# Altium schematic sheet Power_Supply iso backup.SchDoc: Power Supply
size A3; Author: M.Beldyga; CompanyName: WUT ISE; DrawnBy: M.Beldyga; Organization: WUT ISE; Address1: PW ISE; Address2: Nowowiejska 15/19 00-665 Warsaw; Address3: micbeldyga@gmail.com; SheetNumber: 1; SheetTotal: 1; ModifiedBy: -; CheckedDate: -; Title2: +/- 2kV, +/- 15V, 5V; DivGrp: WUT ISE; Designer: M.Beldyga; ModifiedDate: -; ProjectName: Sensor Box
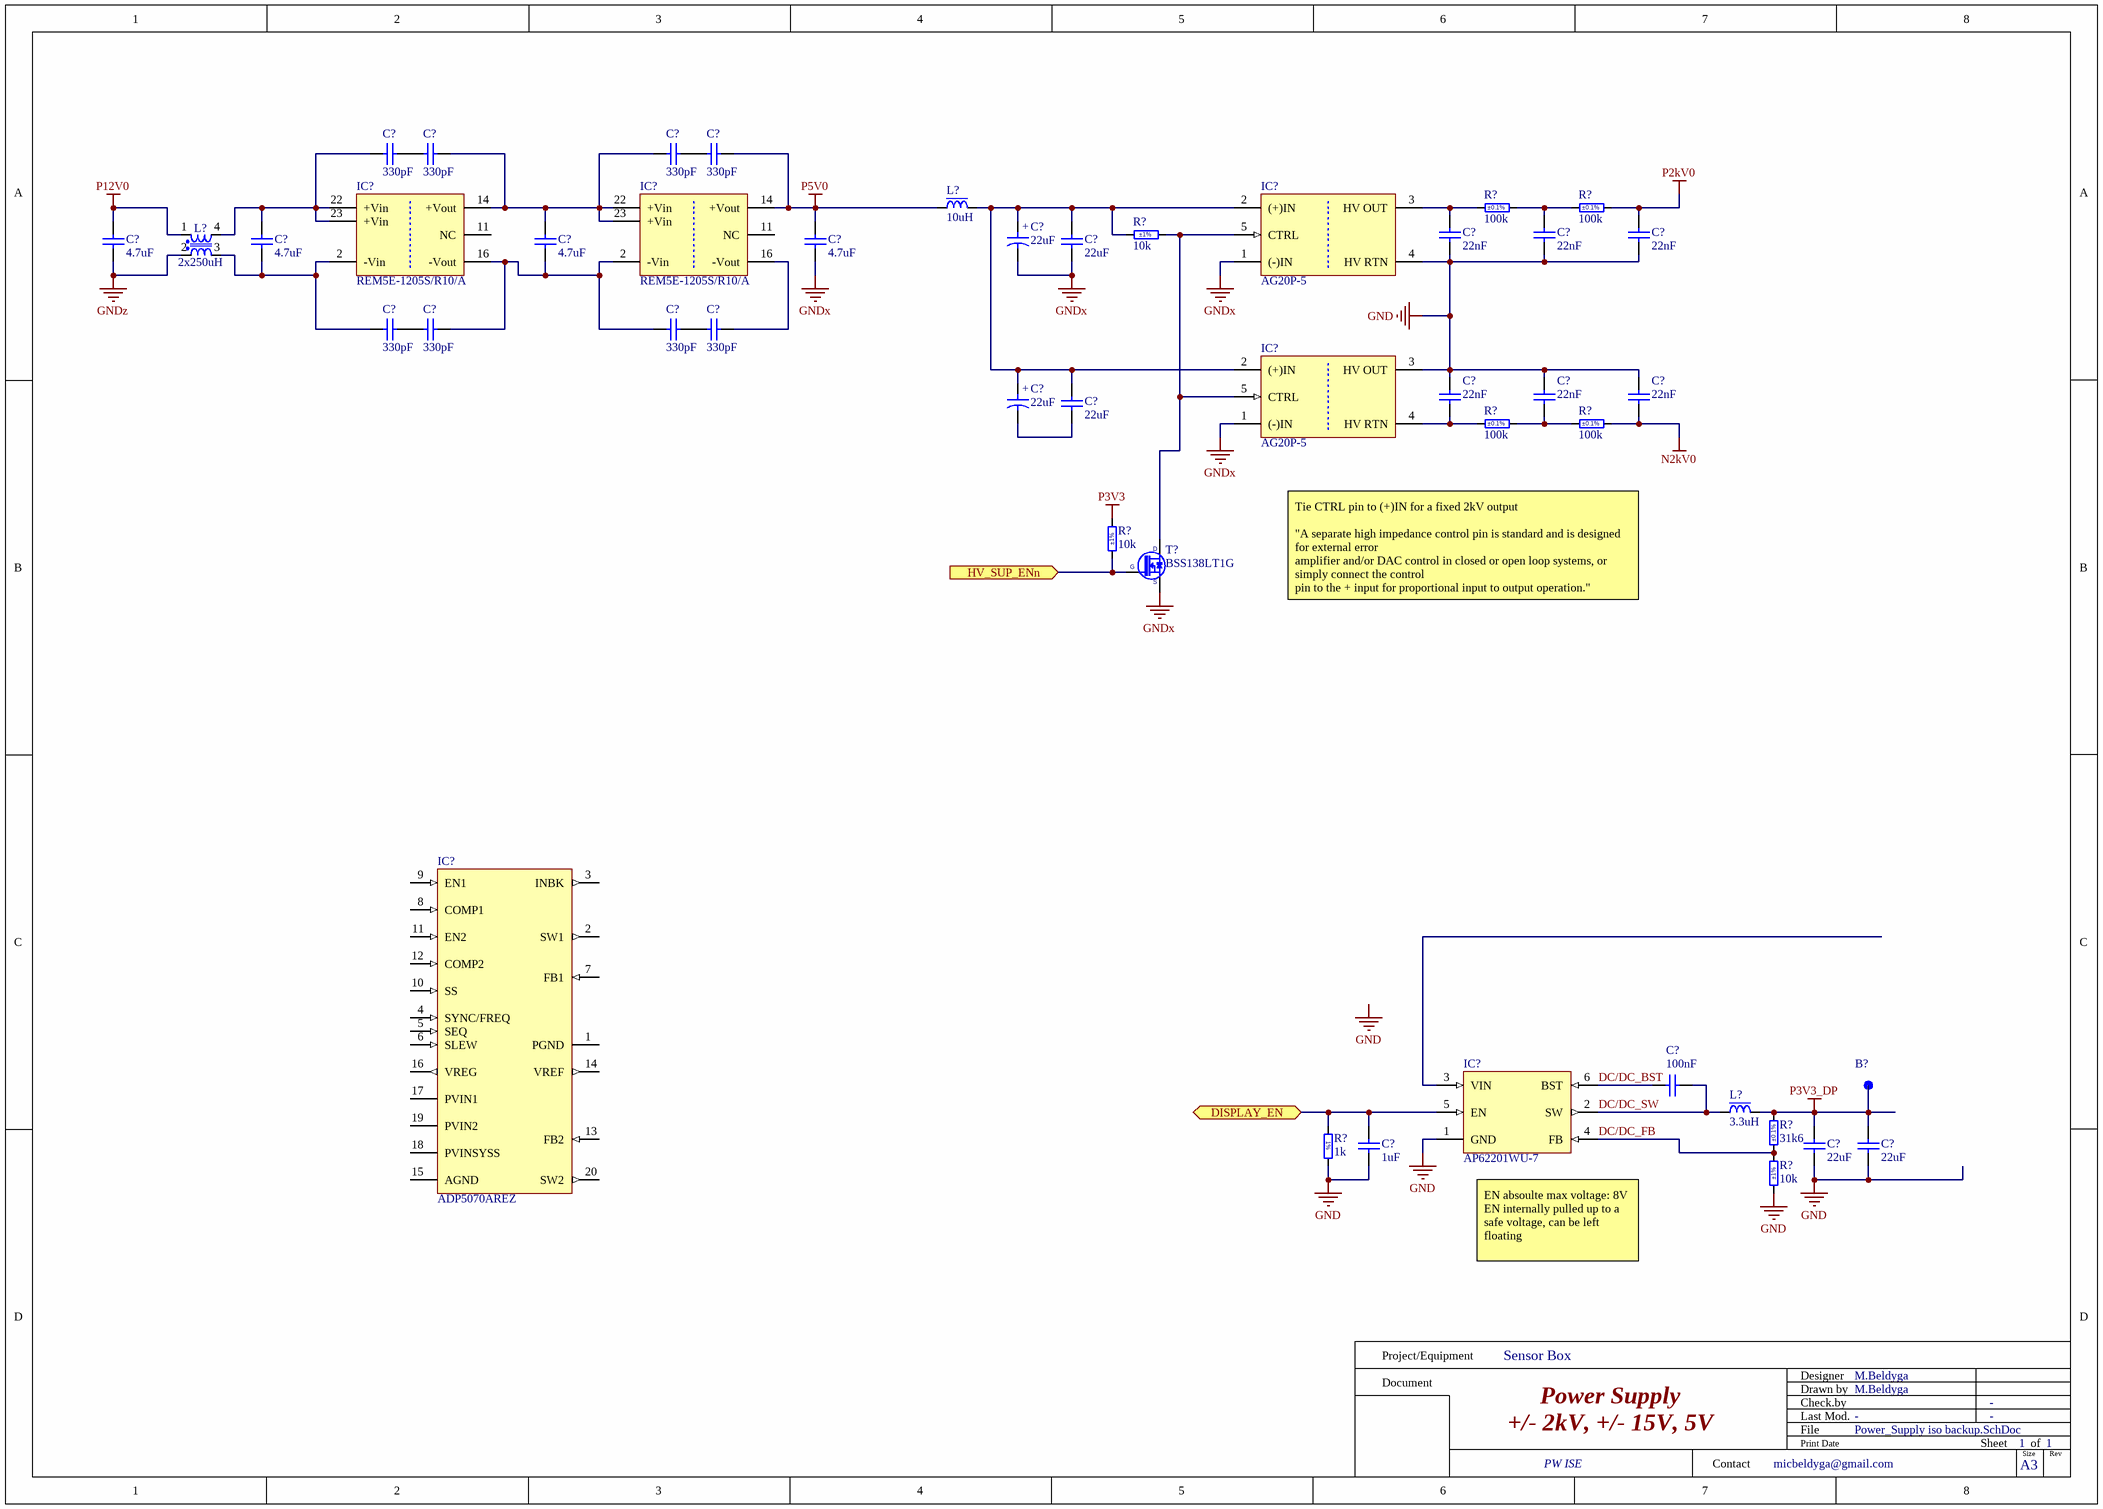
[diagram p0: Power_Supply iso backup.SchDoc]

## Parts
(Parts that share a designator on the sheet are numbered #1, #2 ... from top to bottom, then left to right.)
B?  SMD Pad  [C100]  (value not drawn)  (no BOM)
C?#1  330pF  [CAPC4620X220N]
C?#2  330pF  [CAPC4620X220N]
C?#3  330pF  [CAPC4620X220N]
C?#4  330pF  [CAPC4620X220N]
C?#5  22uF  [CAPMP3528X210N]
C?#6  22nF  [CAPC5764X279N]
C?#7  22nF  [CAPC5764X279N]
C?#8  22nF  [CAPC5764X279N]
C?#9  4.7uF  [CAPC2012X145N]
C?#10  4.7uF  [CAPC2012X145N]
C?#11  4.7uF  [CAPC2012X145N]
C?#12  4.7uF  [CAPC2012X145N]
C?#13  22uF  [CAPC3216X180N]
C?#14  330pF  [CAPC4620X220N]
C?#15  330pF  [CAPC4620X220N]
C?#16  330pF  [CAPC4620X220N]
C?#17  330pF  [CAPC4620X220N]
C?#18  22uF  [CAPMP3528X210N]
C?#19  22nF  [CAPC5764X279N]
C?#20  22nF  [CAPC5764X279N]
C?#21  22nF  [CAPC5764X279N]
C?#22  22uF  [CAPC3216X180N]
C?#23  100nF  [CAPC1005X55N]
C?#24  1uF  [CAPC1005X55N]
C?#25  22uF  [CAPC2012X135N]
C?#26  22uF  [CAPC2012X135N]
IC?#1  REM5E-1205S/R10/A  [DCDC_RECOM_REM5E-XXXXS]
IC?#2  REM5E-1205S/R10/A  [DCDC_RECOM_REM5E-XXXXS]
IC?#3  AG20P-5  [DCDC_XPPOWER_AG0-2KV]
IC?#4  AG20P-5  [DCDC_XPPOWER_AG0-2KV]
IC?#5  ADP5070AREZ  [SOP65P640X120-21N-R305X425]
IC?#6  AP62201WU-7  [SOT95P280X100-6N]
L?#1  10uH  [IND_BOURNS_PM43]
L?#2  2x250uH  [IND_WURTH_WE-SL2]
L?#3  3.3uH  [IND_WURTH_WE-TPC_4828]
R?#1  100k  Tolerance: ±0.1%  [RESC3216X50N]
R?#2  100k  Tolerance: ±0.1%  [RESC3216X50N]
R?#3  10k  Tolerance: ±1%  [RESC1005X40N]
R?#4  100k  Tolerance: ±0.1%  [RESC3216X50N]
R?#5  100k  Tolerance: ±0.1%  [RESC3216X50N]
R?#6  10k  Tolerance: ±1%  [RESC1005X40N]
R?#7  1k  [RESC1005X40N]
R?#8  31k6  Tolerance: ±0.1%  [RESC1005X35N]
R?#9  10k  Tolerance: ±1%  [RESC1005X40N]
T?  BSS138LT1G  [SOT95P240X110-3N]

## Ports
DISPLAY_EN (bidir), HV_SUP_ENn (in)

## Nets
GND: C?#6.1 C?#7.1 C?#8.1 C?#19.2 C?#20.2 C?#21.2 C?#24.1 C?#25.1 C?#26.1 IC?#3.4(HV_RTN) IC?#4.3(HV_OUT) IC?#6.1(GND) R?#7.2 R?#9.1
GNDx: C?#5.2 C?#12.1 C?#13.1 IC?#3.1((-)IN) IC?#4.1((-)IN) T?.2(S)
GNDz: C?#9.1 L?#2.2
N2kV0: C?#21.1 R?#5.2
P2kV0: C?#8.2 R?#2.2
P3V3: R?#6.2
P3V3_DP: B?.1 C?#25.2 C?#26.2 L?#3.2 R?#8.2
P5V0: C?#4.2 C?#12.2 IC?#2.14(+Vout) L?#1.1
P12V0: C?#9.2 L?#2.1
DC/DC_BST: C?#23.1 IC?#6.6(BST)
DC/DC_FB: IC?#6.4(FB) R?#8.1 R?#9.2
DC/DC_SW: C?#23.2 IC?#6.2(SW) L?#3.1
DISPLAY_EN: C?#24.2 IC?#6.5(EN) R?#7.1 ; port DISPLAY_EN
HV_SUP_ENn: R?#6.1 T?.1(G) ; port HV_SUP_ENn
NetC?#1_1: C?#1.1 C?#10.2 IC?#1.22(+Vin) IC?#1.23(+Vin) L?#2.4
NetC?#1_2: C?#1.2 C?#2.1
NetC?#2_2: C?#2.2 C?#3.1 C?#11.2 IC?#1.14(+Vout) IC?#2.22(+Vin) IC?#2.23(+Vin)
NetC?#3_2: C?#3.2 C?#4.1
NetC?#5_1: C?#5.1 C?#13.2 C?#18.1 C?#22.2 IC?#3.2((+)IN) IC?#4.2((+)IN) L?#1.2 R?#3.1
NetC?#6_2: C?#6.2 IC?#3.3(HV_OUT) R?#1.1
NetC?#7_2: C?#7.2 R?#1.2 R?#2.1
NetC?#10_1: C?#10.1 C?#14.1 IC?#1.2(-Vin) L?#2.3
NetC?#11_1: C?#11.1 C?#15.2 C?#16.1 IC?#1.16(-Vout) IC?#2.2(-Vin)
NetC?#14_2: C?#14.2 C?#15.1
NetC?#16_2: C?#16.2 C?#17.1
NetC?#17_2: C?#17.2 IC?#2.16(-Vout)
NetC?#18_2: C?#18.2 C?#22.1
NetC?#19_1: C?#19.1 IC?#4.4(HV_RTN) R?#4.1
NetC?#20_1: C?#20.1 R?#4.2 R?#5.1
NetIC?#3_5: IC?#3.5(CTRL) IC?#4.5(CTRL) R?#3.2 T?.3(D)

Not connected (* = marked no-connect by the designer): IC?#1 11(NC); IC?#2 11(NC); IC?#5 1(PGND) 2(SW1) 3(INBK) 4(SYNC/FREQ) 5(SEQ) 6(SLEW) 7(FB1) 8(COMP1) 9(EN1) 10(SS) 11(EN2) 12(COMP2) 13(FB2) 14(VREF) 15(AGND) 16(VREG) 17(PVIN1) 18(PVINSYSS) 19(PVIN2) 20(SW2); IC?#6 3(VIN)

## Notes on the sheet
- Tie CTRL pin to (+)IN for a fixed 2kV output
  "A separate high impedance control pin is standard and is designed for external error
  amplifier and/or DAC control in closed or open loop systems, or simply connect the control
  pin to the + input for proportional input to output operation."
- (near IC?#6) EN absoulte max voltage: 8V
  EN internally pulled up to a safe voltage, can be left floating
- Labels drawn without touching a wire or pin: GND
- Project/Equipment
- Document
- Designer
- Drawn by
- Check.by
- Contact
- File
- Last Mod.
- Print Date
- Sheet
- Size
- A3
- of
- Rev
- (in symbol CTE3528-21_22UF_20V_10%) +

## Library data of the parts
B? = SMD_PAD_D1MM: Pad; Part Description: 1mm Diameter SMD Pad; Mounted: No; Part Number: SMD_PAD_D1MM; Component Type: Standard (No BOM); Pin Count: 1; Family: SMD Pad; Socket: No; SMD: Yes; Sense: No; Status: None; ComponentHeight: 0mm; HelpURL: Undefined; Author: CERN DEM JLC; CreateDate: 10/10/2017; LatestRevisionDate: 10/10/2017; PackageDescription: 1mm Diameter SMD Pad
C?#1-C?#4 C?#14-C?#17 = CC1808_330pF_6000V_10%_X7R_VISHAY_HV: Non-polarised capacitor; Part Description: SMD Multilayer Ceramic Chip Capacitor Solutions for High Voltage Applications; Manufacturer: VISHAY; Manufacturer Part Number: HV1808Y331KX6ATHV; Voltage: 6000V; TC: X7R; Tolerance: ±10%; Part Number: CC1808_330pF_6000V_10%_X7R_VISHAY_HV; Component Kind: Standard; Component Type: Standard; Pin Count: 2; Value: 330pF; Status: None; Case: 1808; Mounted: Yes; Socket: No; SMD: Yes; Sense: No; ComponentHeight: 2.7mm; HelpURL: \\cern.ch\dfs\Applications\Altium\Datasheets\CC1812_VISHAY_HV.pdf; Author: CERN DEM HF; CreateDate: 2/11/2022; LatestRevisionDate: 2/11/2022
C?#5 C?#18 = CTE3528-21_22UF_20V_10%: Polarised capacitor; Part Description: Solid Tantalum Chip Capacitor; Manufacturer: GENERIC; Manufacturer1 Part Number: TAJB226K020R; Voltage: 20V; Tolerance: ±10%; Part Number: CTE3528-21_22UF_20V_10%; Component Kind: Standard; Component Type: Standard; Pin Count: 2; Value: 22uF; Status: Preferred; Manufacturer Part Number: CTE3528-21_22UF_20V_10%; Case: B; Mounted: Yes; Socket: No; SMD: Yes; Sense: No; Manufacturer1 Example: AVX; Manufacturer1 ComponentHeight: 2.1mm; HelpURL: \\cern.ch\dfs\Applications\Altium\Datasheets\CTE_AVX_TAJ.pdf; Author: CERN DEM JLC; CreateDate: 12/3/2007; LatestRevisionDate: 12/3/2007
C?#6-C?#8 C?#19-C?#21 = CC2225_22NF_2.5KV_10%_X7R: Non-polarised capacitor; Part Description: High Voltage MLC Chip Capacitor; Manufacturer: GENERIC; Manufacturer1 Part Number: 2225WC223KAT1A; Voltage: 2.5KV; TC: X7R; Tolerance: ±10%; Part Number: CC2225_22NF_2.5KV_10%_X7R; Component Kind: Standard; Component Type: Standard; Pin Count: 2; Value: 22nF; Status: None; Manufacturer Part Number: CC2225_22NF_2.5KV_10%_X7R; Case: 2225; Mounted: Yes; Socket: No; SMD: Yes; Sense: No; Manufacturer1 Example: AVX; Manufacturer1 ComponentHeight: 2.79mm; HelpURL: \\cern.ch\dfs\Applications\Altium\Datasheets\CC2225_X7R_AVX_HV-MLC.pdf; Author: CERN DEM JLC; CreateDate: 10/21/2014; LatestRevisionDate: 4/1/2015
C?#9-C?#12 = CC0805_4.7UF_50V_10%_X7R: Non-polarised capacitor; Part Description: SMD Multilayer Chip Ceramic Capacitor; Manufacturer: GENERIC; Manufacturer1 Part Number: C2012X7R1H475K125; Voltage: 50V; TC: X7R; Tolerance: ±10%; Part Number: CC0805_4.7UF_50V_10%_X7R; Component Kind: Standard; Component Type: Standard; Pin Count: 2; Value: 4.7uF; Status: Preferred; Manufacturer Part Number: CC0805_4.7UF_50V_10%_X7R; Case: 0805; Mounted: Yes; Socket: No; SMD: Yes; Sense: No; Manufacturer1 Example: TDK; Manufacturer1 ComponentHeight: 1.45mm; HelpURL: \\cern.ch\dfs\Applications\Altium\Datasheets\CC0805_X7R_TDK_C.pdf; Author: CERN DEM JMW; CreateDate: 7/30/2021; LatestRevisionDate: 7/30/2021
C?#13 C?#22 = CC1206_22UF_25V_20%_X5R: Non-polarised capacitor; Part Description: SMD Multilayer Chip Ceramic Capacitor; Manufacturer: GENERIC; Manufacturer1 Part Number: C3216X5R1E226M160; Voltage: 25V; TC: X5R; Tolerance: ±20%; Part Number: CC1206_22UF_25V_20%_X5R; Component Kind: Standard; Component Type: Standard; Pin Count: 2; Value: 22uF; Status: None; Manufacturer Part Number: CC1206_22UF_25V_20%_X5R; Case: 1206; Mounted: Yes; Socket: No; SMD: Yes; Sense: No; Manufacturer1 Example: TDK; Manufacturer1 ComponentHeight: 1.8mm; HelpURL: \\cern.ch\dfs\Applications\Altium\Datasheets\CC1206_X5R_TDK_C.pdf; Author: CERN DEM WB; CreateDate: 7/25/2018; LatestRevisionDate: 7/25/2018
C?#23 = CC0402_100NF_16V_10%_X7R: Non-polarised capacitor; Part Description: SMD Multilayer Chip Ceramic Capacitor; Manufacturer: GENERIC; Manufacturer1 Part Number: GRM155R71C104KA88D; Voltage: 16V; TC: X7R; Tolerance: ±10%; Part Number: CC0402_100NF_16V_10%_X7R; Component Kind: Standard; Component Type: Standard; Pin Count: 2; Value: 100nF; Status: Not Recommended; Manufacturer Part Number: CC0402_100NF_16V_10%_X7R; Case: 0402; Mounted: Yes; Socket: No; SMD: Yes; Sense: No; Manufacturer1 Example: MURATA; Manufacturer1 ComponentHeight: 0.55mm; HelpURL: \\cern.ch\dfs\Applications\Altium\Datasheets\CC0402_X7R_MURATA_GRM.pdf; Author: CERN DEM JLC; CreateDate: 12/5/2013; LatestRevisionDate: 12/3/2007
C?#24 = CC0402_1UF_16V_10%_X5R: SMD Mulitlayer Ceramic Chip Capacitor; Manufacturer: GENERIC; Manufacturer 1: Murata; Manufacturer 1 Part Number: GRT155R61C105KE01D; Manufacturer 2 Part Number: CL05A105KO5NNNC; Manufacturer 3 Part Number: CC0402KRX5R7BB105; Voltage: 16V; TC: X5R; Tolerance: ±10%; Part Number: CC0402_1UF_16V_10%_X5R; Component Kind: Standard; Component Type: Standard; Pin Count: 2; Value: 1uF; Manufacturer Part Number: CC0402_1UF_16V_10%_X5R; Case: 0402; Status: None; ComponentHeight: 0.55mm; SMD: Yes; Manufacturer 2: Samsung; Manufacturer 3: YAGEO; Author: Michal Beldyga; CreateDate: 10/28/2024; LatestRevisionDate: 10/28/2024
C?#25 C?#26 = CC0805_22UF_16V_10%_X5R: Non-polarised capacitor; Part Description: SMD Multilayer Chip Ceramic Capacitor; Manufacturer: GENERIC; Manufacturer1 Part Number: C2012X5R1C226KT; Voltage: 16V; TC: X5R; Tolerance: ±10%; Part Number: CC0805_22UF_16V_10%_X5R; Component Kind: Standard; Component Type: Standard; Pin Count: 2; Value: 22uF; Status: Preferred; Manufacturer Part Number: CC0805_22UF_16V_10%_X5R; Case: 0805; Mounted: Yes; Socket: No; SMD: Yes; Sense: No; Manufacturer1 Example: TDK; Manufacturer1 ComponentHeight: 1.35mm; HelpURL: \\cern.ch\dfs\Applications\Altium\Datasheets\CC0805_X5R_TDK_C.pdf; Author: CERN DEM JLC; CreateDate: 10/25/2012; LatestRevisionDate: 10/25/2012
IC?#1 IC?#2 = REM5E-1205S/R10/A: RECOM, RP Series, Single Output DCDC Converter; Part Description: 12VDC to +5V (+1A), 5W Regulated DC-DC Converter; PressFit: No; Bonding: No; Part Number: REM5E-1205S/R10/A; Component Kind: Standard; Component Type: Standard; Device: REM5E-1205S/R10/A; PackageDescription: REM5E-XXXXS Series, Body 31.8x20.3mm, DIP-24 Package; Manufacturer: RECOM; Manufacturer Part Number: REM5E-1205S/R10/A; Pin Count: 6; Mounted: Yes; Socket: No; SMD: No; Sense: No; ComponentHeight: 10.2mm; HelpURL: \\cern.ch\dfs\Applications\Altium\Datasheets\RECOM_REM5E-XXXXS.pdf; Author: CERN DEM HF; CreateDate: 2/8/2022; LatestRevisionDate: 2/8/2022
IC?#3 IC?#4 = AG20P-5: XP POWER, AG Series, DC/HVDC Converter; Part Description: 5VDC to 0-2kVDC, Iout (max) 0.5mA, 1W DC-HVDC Converter; PressFit: No; Bonding: No; Part Number: AG20P-5; Component Kind: Standard; Component Type: Standard; Device: AG20P-5; PackageDescription: AG Series, DC/HVDC Converter, Body W 11.43mm x L 23.37mm x H 6.35mm; Manufacturer: XP POWER; Manufacturer Part Number: AG20P-5; Pin Count: 5; Mounted: Yes; Socket: No; SMD: Yes; Sense: No; ComponentHeight: 3.3mm; HelpURL: \\cern.ch\dfs\Applications\Altium\Datasheets\XPPOWER_AG-Series.pdf; Author: CERN DEM BC; CreateDate: 9/18/2020; LatestRevisionDate: 9/18/2020
IC?#5 = ADP5070AREZ: 1A/0.6A, DC-to-DC Switching Regulator with Independent Positive and Negative Outputs; Manufacturer: ANALOG DEVICES; PressFit: No; Bonding: No; Part Number: ADP5070AREZ; Component Kind: Standard; Component Type: Standard; Device: ADP5070AREZ; PackageDescription: SOP, 0.65mm Pitch; 20 Pin, 4.40mm W X 6.50mm L X 1.20mm H Body (w/Thermal Tab 3.05mm X 4.25mm), IPC Medium Density; Part Description: 1A/0.6A, DC-to-DC Switching Regulator with Independent Positive and Negative Outputs; Manufacturer Part Number: ADP5070ARE; Pin Count: 20; Case: SSOP20; Mounted: Yes; Socket: No; SMD: Yes; Sense: No; ComponentHeight: 1.2mm; HelpURL: \\cern.ch\dfs\Applications\Altium\Datasheets\ADP5070AREZ.pdf; Author: CERN DEM JLC; CreateDate: 6/21/2017; LatestRevisionDate: 4/1/2022
IC?#6 = AP62201WU-7: 4.2V TO 18V INPUT, 2A LOW IQ SYNCHRONOUS BUCK CONVERTER; Manufacturer: DIODES INCORPORATED; PressFit: No; Bonding: No; Part Number: AP62201WU-7; Component Kind: Standard; Component Type: Standard; Device: AP62201WU-7; PackageDescription: SOT23, 0.95mm Pitch; 6 Pin, 1.625mm W X 2.90mm L X 1.00mm H body, IPC Medium Density; Part Description: 4.2V To 18V Input, 2A Low Iq Synchronous Buck Converter; Manufacturer Part Number: AP62201WU; Pin Count: 6; Case: SOT23-6; Mounted: Yes; Socket: No; SMD: Yes; Sense: No; ComponentHeight: 1.1mm; HelpURL: \\cern.ch\dfs\Applications\Altium\Datasheets\AP6220x.pdf; Author: CERN DEM HF; CreateDate: 1/7/2022; LatestRevisionDate: 3/21/2022
L?#1 = IND_10UH_20%_BOURNS_PM43: Inductor With Core; Part Description: SMD Power Inductor; Manufacturer: BOURNS; Manufacturer Part Number: PM43-100M-RC; Power: 1.15A; Resistance: 0.18R; Tolerance: ±20%; Part Number: IND_10UH_20%_BOURNS_PM43; Component Kind: Standard; Component Type: Standard; Pin Count: 2; Value: 10uH; Mounted: Yes; Socket: No; SMD: Yes; Sense: No; ComponentHeight: 3.5mm; HelpURL: \\cern.ch\dfs\Applications\Altium\Datasheets\IND_BOURNS_PM43.pdf; Author: CERN DEM JLC; CreateDate: 5/17/2011; LatestRevisionDate: 5/17/2011
L?#2 = IND_250UH_50%_WURTH_WE-SL2-744224: Inductor Common Mode; Part Description: Common Mode SMD Line Filter (WE-SL2 Series); Manufacturer: WURTH ELEKTRONIK; Manufacturer Part Number: 744224; Power: 1.2A; Resistance: 0.13R; Tolerance: ±50%; Part Number: IND_250UH_50%_WURTH_WE-SL2-744224; Component Kind: Standard; Component Type: Standard; Pin Count: 4; Value: 2x250uH; Mounted: Yes; Socket: No; SMD: Yes; Sense: No; ComponentHeight: 5.3mm; HelpURL: \\cern.ch\dfs\Applications\Altium\Datasheets\IND_WURTH_WE-SL2_744224.pdf; Author: CERN DEM JLC; CreateDate: 02.12.2009; LatestRevisionDate: 15.10.2012
L?#3 = IND_3.3UH_30%_WURTH_WE-TPC_744043003: Inductor With Core; Part Description: Shielded Tiny Power Inductor (WE-TPC Serie); Manufacturer: WURTH ELEKTRONIK; Power: 2.15A; Resistance: 0.03R; Tolerance: ±30%; Part Number: IND_3.3UH_30%_WURTH_WE-TPC_744043003; Component Kind: Standard; Component Type: Standard; Pin Count: 2; Value: 3.3uH; Manufacturer Part Number: 744043003; Mounted: Yes; Socket: No; SMD: Yes; Sense: No; ComponentHeight: 3mm; HelpURL: \\cern.ch\dfs\Applications\Altium\Datasheets\IND_WURTH_WE-TPC_744043003.pdf; Author: CERN DEM JLC; CreateDate: 7/12/2011; LatestRevisionDate: 1/24/2012
R?#1 R?#2 R?#4 R?#5 = R1206_100K_0.1%_0.4W_25PPM_VISHAY_PAT: Resistor - 0.1%; Part Description: Precision Automotive Thin Film Chip Resistor 2kV ESD Rating; Manufacturer: VISHAY DALE THIN FILM; Manufacturer Part Number: PAT1206E1003BS; Power: 0.4W; TC: ±25ppm/°C; PressFit: No; Part Number: R1206_100K_0.1%_0.4W_25PPM_VISHAY_PAT; Component Kind: Standard; Component Type: Standard; Pin Count: 2; Value: 100k; Status: Not Recommended; Case: 1206; Mounted: Yes; Sense: No; Socket: No; SMD: Yes; ComponentHeight: 0.5mm; HelpURL: \\cern.ch\dfs\Applications\Altium\Datasheets\R1206_VISHAY_PAT.pdf; Author: CERN DEM MR; CreateDate: 7/19/2016; LatestRevisionDate: 6/28/2022
R?#3 R?#6 R?#9 = R0402_10K_1%_0.0625W_100PPM: Resistor - 1%; Part Description: General Purpose Thick Film Chip Resistor; Manufacturer: GENERIC; Manufacturer1 Part Number: 232270671003L; TC: ±100ppm/°C; PressFit: No; Part Number: R0402_10K_1%_0.0625W_100PPM; Component Kind: Standard; Component Type: Standard; Pin Count: 2; Value: 10k; Status: Not Recommended; Power: 0.0625W; Manufacturer Part Number: R0402_10K_1%_0.0625W_100PPM; Case: 0402; Mounted: Yes; Sense: No; Socket: No; SMD: Yes; Manufacturer1 Example: YAGEO PHYCOMP; Manufacturer1 ComponentHeight: 0.4mm; HelpURL: \\cern.ch\dfs\Applications\Altium\Datasheets\R0402_Phycomp_RC0402.pdf; Author: CERN DEM JLC; CreateDate: 12/3/2007; LatestRevisionDate: 10/17/2012
R?#7 = R0402_1K_1%_0.0625W: RES 1k OHM 1% 1/16W 0402; Manufacturer: GENERIC; Manufacturer 1: Yageo; Manufacturer Part Number 1: RC0402FR-071KL; Part Number: R0402_1K_1%_0.0625W; Component Kind: Standard; Component Type: Standard; Pin Count: 2; Value: 1k; Power: 0.0625W; Tolerance: 1%; Case: 0402; Status: Active; Manufacturer 2: Stackpole Electronics; Manufacturer Part Number 2: RMCF0402FT1K00; Manufacturer 3: Vishay Dale; Manufacturer Part Number 3: CRCW04021K00FKED; Author: Michal Beldyga; CreateDate: 9/16/2024; LastRevision: 9/16/2024
R?#8 = R0402_31K6_0.1%_0.063W_25PPM_YAGEO_RT: Resistor - 0.1%; Part Description: Thin Film Chip Resistor; Manufacturer: YAGEO; Manufacturer Part Number: RT0402BRD0731K6L; Power: 0.063W; TC: ±25ppm/°C; Voltage: 50V; PressFit: No; Part Number: R0402_31K6_0.1%_0.063W_25PPM_YAGEO_RT; Component Kind: Standard; Component Type: Standard; Pin Count: 2; Value: 31k6; Status: Not Recommended; Case: 0402; Mounted: Yes; Sense: No; Socket: No; SMD: Yes; ComponentHeight: 0.35mm; HelpURL: \\cern.ch\dfs\Applications\Altium\Datasheets\R0402_YAGEO_RT.pdf; Author: CERN DEM BC; CreateDate: 7/30/2020; LatestRevisionDate: 7/30/2020
T? = BSS138LT1G: N-CHANNEL MOSFET WITH DIODE; Part Description: 50V, 200mA N-Channel Enhancement Mode Field-Effect Transistor; Manufacturer: ON SEMICONDUCTOR; PressFit: No; Bonding: No; Part Number: BSS138LT1G; Component Kind: Standard; Component Type: Standard; Device: BSS138LT1G; PackageDescription: SOT23, 0.95mm Pitch; 3 Pin, 1.40mm W X 3.00mm L X 1.10mm H body, IPC Medium Density; Manufacturer Part Number: BSS138L; Pin Count: 3; Case: SOT23-3; Mounted: Yes; Socket: No; SMD: Yes; Sense: No; ComponentHeight: 1.11mm; HelpURL: \\cern.ch\dfs\Applications\Altium\Datasheets\BSS138LT1G.pdf; Author: CERN DEM JLC; CreateDate: 3/23/2009; LatestRevisionDate: 5/25/2022